# EAGLE schematic NXP FRDM K66F (EAGLE 8.7.1)
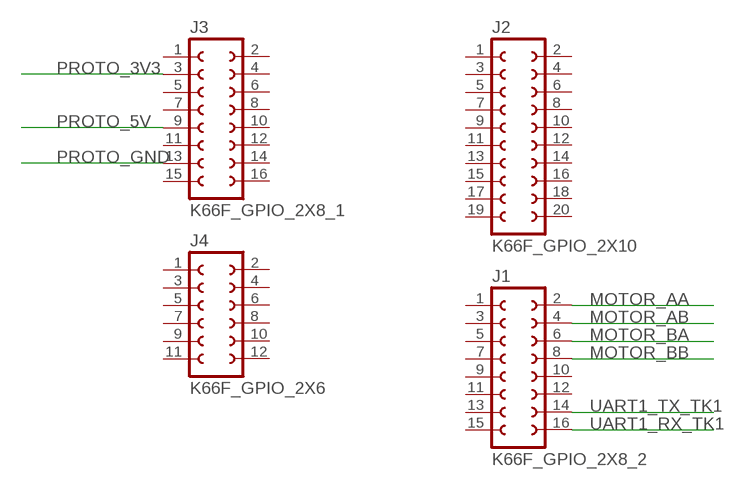
[diagram p0: schematic, sheet 1]

## Parts
J1  K66F_GPIO_2X8_2  [K66F_GPIO_2X8]
J2  K66F_GPIO_2X10  [K66F_GPIO_2X10]
J3  K66F_GPIO_2X8_1  [K66F_GPIO_2X8]
J4  K66F_GPIO_2X6  [K66F_GPIO_2X6]

## Nets
MOTOR_AA: J1.2
MOTOR_AB: J1.4
MOTOR_BA: J1.6
MOTOR_BB: J1.8
PROTO_3V3: J3.3
PROTO_5V: J3.9
PROTO_GND: J3.13
UART1_RX_TK1: J1.16
UART1_TX_TK1: J1.14
Unconnected: J1.1 J1.3 J1.5 J1.7 J1.9 J1.10 J1.11 J1.12 J1.13 J1.15 J2.1 J2.2 J2.3 J2.4 J2.5 J2.6 J2.7 J2.8 J2.9 J2.10 J2.11 J2.12 J2.13 J2.14 J2.15 J2.16 J2.17 J2.18 J2.19 J2.20 J3.1 J3.2 J3.4 J3.5 J3.6 J3.7 J3.8 J3.10 J3.11 J3.12 J3.14 J3.15 J3.16 J4.1 J4.2 J4.3 J4.4 J4.5 J4.6 J4.7 J4.8 J4.9 J4.10 J4.11 J4.12

## Library data of the parts
J1 = Parts:K66F_GPIO_2X8_2
J2 = Parts:K66F_GPIO_2X10
J3 = Parts:K66F_GPIO_2X8_1
J4 = Parts:K66F_GPIO_2X6